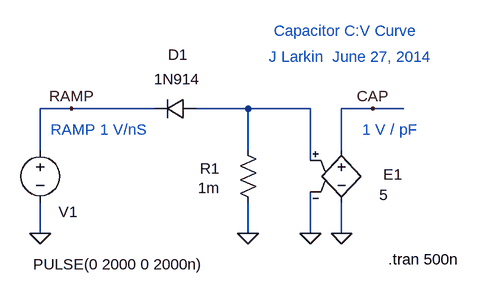
[diagram p0: schematic Cap_Sweep.asc]
Cap_Sweep.asc, the LTspice schematic file:
Version 4
SHEET 1 896 680
WIRE 48 80 0 80
WIRE 176 80 48 80
WIRE 320 80 240 80
WIRE 416 80 320 80
WIRE 512 80 464 80
WIRE 560 80 512 80
WIRE 0 144 0 80
WIRE 320 144 320 80
WIRE 464 144 464 80
WIRE 416 160 416 80
WIRE 0 272 0 224
WIRE 320 272 320 224
WIRE 416 272 416 208
WIRE 464 272 464 224
FLAG 0 272 0
FLAG 320 272 0
FLAG 416 272 0
FLAG 464 272 0
FLAG 512 80 CAP
FLAG 48 80 RAMP
SYMBOL diode 240 64 R90
WINDOW 0 -52 28 VBottom 2
WINDOW 3 -45 29 VTop 2
SYMATTR InstName D1
SYMATTR Value 1N914
SYMBOL res 304 128 R0
WINDOW 0 -58 44 Left 2
WINDOW 3 -61 74 Left 2
SYMATTR InstName R1
SYMATTR Value 1m
SYMBOL voltage 0 128 R0
WINDOW 0 28 111 Left 2
WINDOW 3 -11 192 Left 2
WINDOW 123 0 0 Left 2
WINDOW 39 0 0 Left 2
SYMATTR InstName V1
SYMATTR Value PULSE(0 2000 0 2000n)
SYMBOL e 464 128 R0
WINDOW 0 64 53 Left 2
WINDOW 3 58 85 Left 2
SYMATTR InstName E1
SYMATTR Value 5
TEXT 16 112 Left 2 ;RAMP 1 V/nS
TEXT 496 112 Left 2 ;1 V / pF
TEXT 536 312 Left 2 !.tran 500n
TEXT 360 -40 Left 2 ;Capacitor C:V Curve
TEXT 352 0 Left 2 ;J Larkin  June 27, 2014

The netlist it stands for:
* Cap_Sweep.asc
D1 N001 RAMP 1N914
R1 N001 0 1m
V1 RAMP 0 PULSE(0 2000 0 2000n)
E1 CAP 0 N001 0 5
.model D D
.lib standard.dio
* RAMP 1 V/nS
* 1 V / pF
.tran 500n
* Capacitor C:V Curve
* J Larkin  June 27, 2014
.backanno
.end